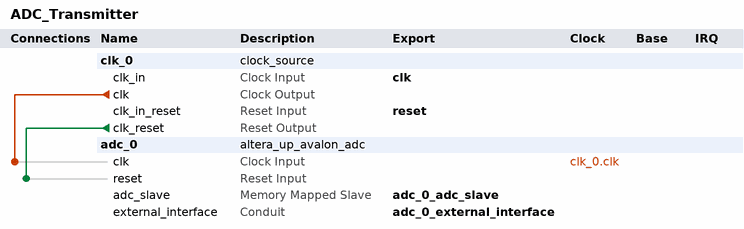
[diagram p0: system contents]
# Platform Designer (Qsys) system ADC_Transmitter, Cyclone V 5CGXFC7C7F23C8
# Parameters at their usual value, and those the tool derives, are not listed.
package require -exact qsys 17.0
create_system ADC_Transmitter
set_project_property DEVICE_FAMILY {Cyclone V}
set_project_property DEVICE 5CGXFC7C7F23C8

add_instance clk_0 clock_source 17.0
set_instance_parameter_value clk_0 clockFrequency 2000000

add_instance adc_0 altera_up_avalon_adc 17.0
set_instance_parameter_value adc_0 board DE10-Nano
set_instance_parameter_value adc_0 numch_ 8
set_instance_parameter_value adc_0 sclk_freq 2.0

# connections
add_connection clk_0.clk adc_0.clk clock
add_connection clk_0.clk_reset adc_0.reset reset

# exported interfaces
add_interface adc_0_adc_slave avalon slave
set_interface_property adc_0_adc_slave EXPORT_OF adc_0.adc_slave
add_interface adc_0_external_interface conduit end
set_interface_property adc_0_external_interface EXPORT_OF adc_0.external_interface
add_interface clk clock sink
set_interface_property clk EXPORT_OF clk_0.clk_in
add_interface reset reset sink
set_interface_property reset EXPORT_OF clk_0.clk_in_reset

set_interconnect_requirement {$system} qsys_mm.clockCrossingAdapter HANDSHAKE
set_interconnect_requirement {$system} qsys_mm.enableEccProtection FALSE
set_interconnect_requirement {$system} qsys_mm.insertDefaultSlave FALSE
set_interconnect_requirement {$system} qsys_mm.maxAdditionalLatency 1

save_system ADC_Transmitter.qsys
